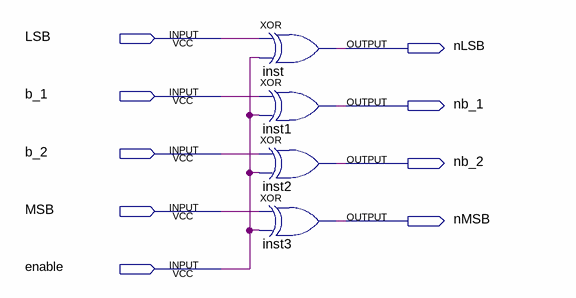
[diagram p0: schematic sheet]
// Quartus schematic 4bit_not.bdf as structural Verilog: 4 symbols, 9 pins
module \4bit_not  (
  input  LSB,
  input  b_1,
  input  b_2,
  input  MSB,
  input  enable,
  output nLSB,
  output nb_1,
  output nb_2,
  output nMSB
);

  xor inst (nLSB, LSB, enable);
  xor inst1 (nb_1, b_1, enable);
  xor inst2 (nb_2, b_2, enable);
  xor inst3 (nMSB, MSB, enable);
endmodule
